# Altium schematic sheet Interfaz_RS232.SchDoc
size Letter; ApprovedBy: M. en C. Fernando Bolaños; CheckedBy: M. en C. José Alberto Balderas Castillo (CID); Author: M. en C. José Alberto Balderas Castillo (CID); Revision: v1; NombreTarjeta: TELCOMGPRS-v1; NumeroDeHoja: 5 de 7; NombreBloque: Puertos Seriales RS232 Externos; FechaDiseno: 02-Junio-2015; FechaRevision: 05-Junio-2015; FechaAprobacion: 16-Junio-2015; TamanoHoja: Carta; NombreProyecto: Telemetria GPRS de Bajo Consumo de Energia
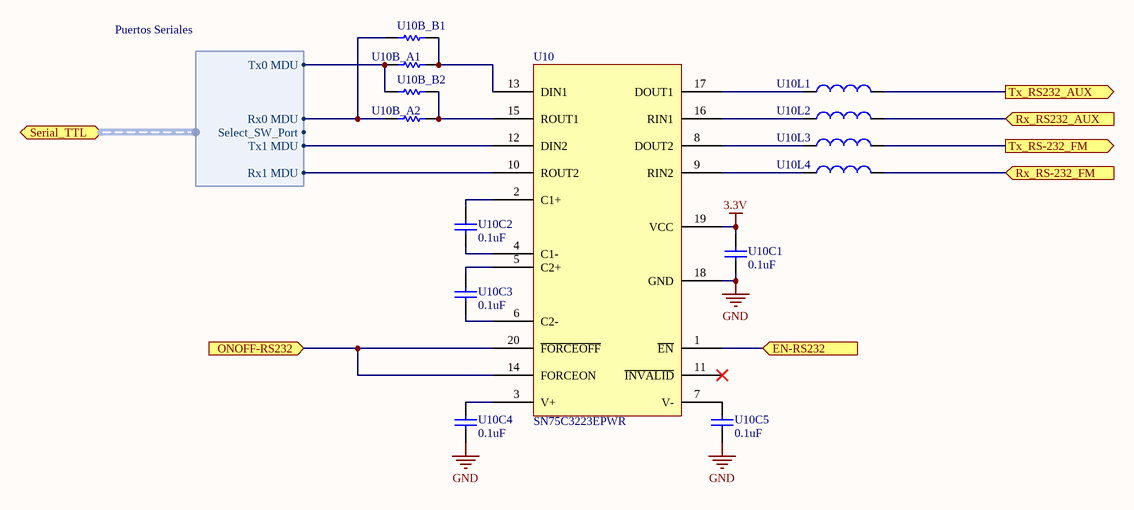
[diagram p0: Interfaz_RS232.SchDoc]

## Parts
U10  SN75C3223EPWR  [TSSOP-20]
U10B_A1  (no value)  [Bypass Bridge]
U10B_A2  (no value)  [Bypass Bridge]
U10B_B1  (no value)  [Bypass Bridge]
U10B_B2  (no value)  [Bypass Bridge]
U10C1  0.1uF  [0603 - CAP]
U10C2  0.1uF  [0603 - CAP]
U10C3  0.1uF  [0603 - CAP]
U10C4  0.1uF  [0603 - CAP]
U10C5  0.1uF  [0603 - CAP]
U10L1  74279214  [1206-IND]  (value not drawn)
U10L2  74279214  [1206-IND]  (value not drawn)
U10L3  74279214  [1206-IND]  (value not drawn)
U10L4  74279214  [1206-IND]  (value not drawn)

## Ports
EN-RS232 (in), ONOFF-RS232 (in), Rx_RS232_AUX (in), Rx_RS-232_FM (in), Serial_TTL (harness Puertos Seriales), Tx_RS232_AUX (out), Tx_RS-232_FM (out)

## Harnesses
Puertos Seriales: Select_SW_Port, Tx0 MDU, Rx1 MDU, Rx0 MDU, Tx1 MDU

## Nets
3.3V: U10.19(VCC) U10C1.2
GND: U10.18(GND) U10C1.1 U10C4.1 U10C5.1
EN-RS232: U10.1(~{EN}) ; port EN-RS232
ONOFF-RS232: U10.14(FORCEON) U10.20(~{FORCEOFF}) ; port ONOFF-RS232
Rx_RS232_AUX: U10L2.2 ; port Rx_RS232_AUX
Rx_RS-232_FM: U10L4.2 ; port Rx_RS-232_FM
Tx_RS232_AUX: U10L1.2 ; port Tx_RS232_AUX
Tx_RS-232_FM: U10L3.2 ; port Tx_RS-232_FM
NetU10_2: U10.2(C1+) U10C2.2
NetU10_3: U10.3(V+) U10C4.2
NetU10_4: U10.4(C1-) U10C2.1
NetU10_5: U10.5(C2+) U10C3.2
NetU10_6: U10.6(C2-) U10C3.1
NetU10_7: U10.7(V-) U10C5.2
NetU10_8: U10.8(DOUT2) U10L3.1
NetU10_9: U10.9(RIN2) U10L4.1
NetU10_10: U10.10(ROUT2) ; port Serial_TTL.Rx1 MDU
NetU10_12: U10.12(DIN2) ; port Serial_TTL.Tx1 MDU
NetU10_13: U10.13(DIN1) U10B_A1.2 U10B_B1.1
NetU10_15: U10.15(ROUT1) U10B_A2.2 U10B_B2.1
NetU10_16: U10.16(RIN1) U10L2.1
NetU10_17: U10.17(DOUT1) U10L1.1
NetU10B_A1_1: U10B_A1.1 U10B_B2.2 ; port Serial_TTL.Tx0 MDU
NetU10B_A2_1: U10B_A2.1 U10B_B1.2 ; port Serial_TTL.Rx0 MDU

Not connected (* = marked no-connect by the designer): U10 11(~{INVALID})*

## Notes on the sheet
- Elaboró
- Fecha
- Nombre del artículo
- Revisó
- Aprobó
- Número de parte
- Revisión
- Escala
- N/A
- Sección afectada
- Descripción del cambio
- Lámina
- 1/1
- Tolerancias
- Ruta del archivo

## Library data of the parts
U10 = SN75C3223EPWR: IC LINE DRVR/RCVR RS232 20-TSSOP; Manufacturer: Texas Instruments; Manufacturer Part Number: SN75C3223EPWR; Supplier 1: Digi-Key; Supplier Part Number 1: 296-21078-1-ND
U10B_A1 U10B_A2 U10B_B1 U10B_B2 = Res1: No Aplica; Numero de Parte: No Aplica
U10C1-U10C5 = Cap: CAP CERAMIC 0.1UF, 25V, X7R, 0603; Manufacturer Part Number: CGJ3E2X7R1E104K080AA; Manufacturer: TDK Corporation; Value: 0.1uF; Supplier 1: Digi-Key; Supplier Part Number 1: 445-8129-1-ND
U10L1-U10L4 = Inductor: FERRITE BEAD 1000 OHM .20A 1206; Manufacturer: Wurth Elektronik; Value: 450 mΩ; Manufacturer Part Number: 74279214; Supplier Part Number 1: 74279214; Supplier 1: Wurth Elektronik; Supplier 2: Digi-Key; Supplier Part Number 2: 732-1627-1-ND